# EAGLE design Battery_Buttons (EAGLE 7.6.0)
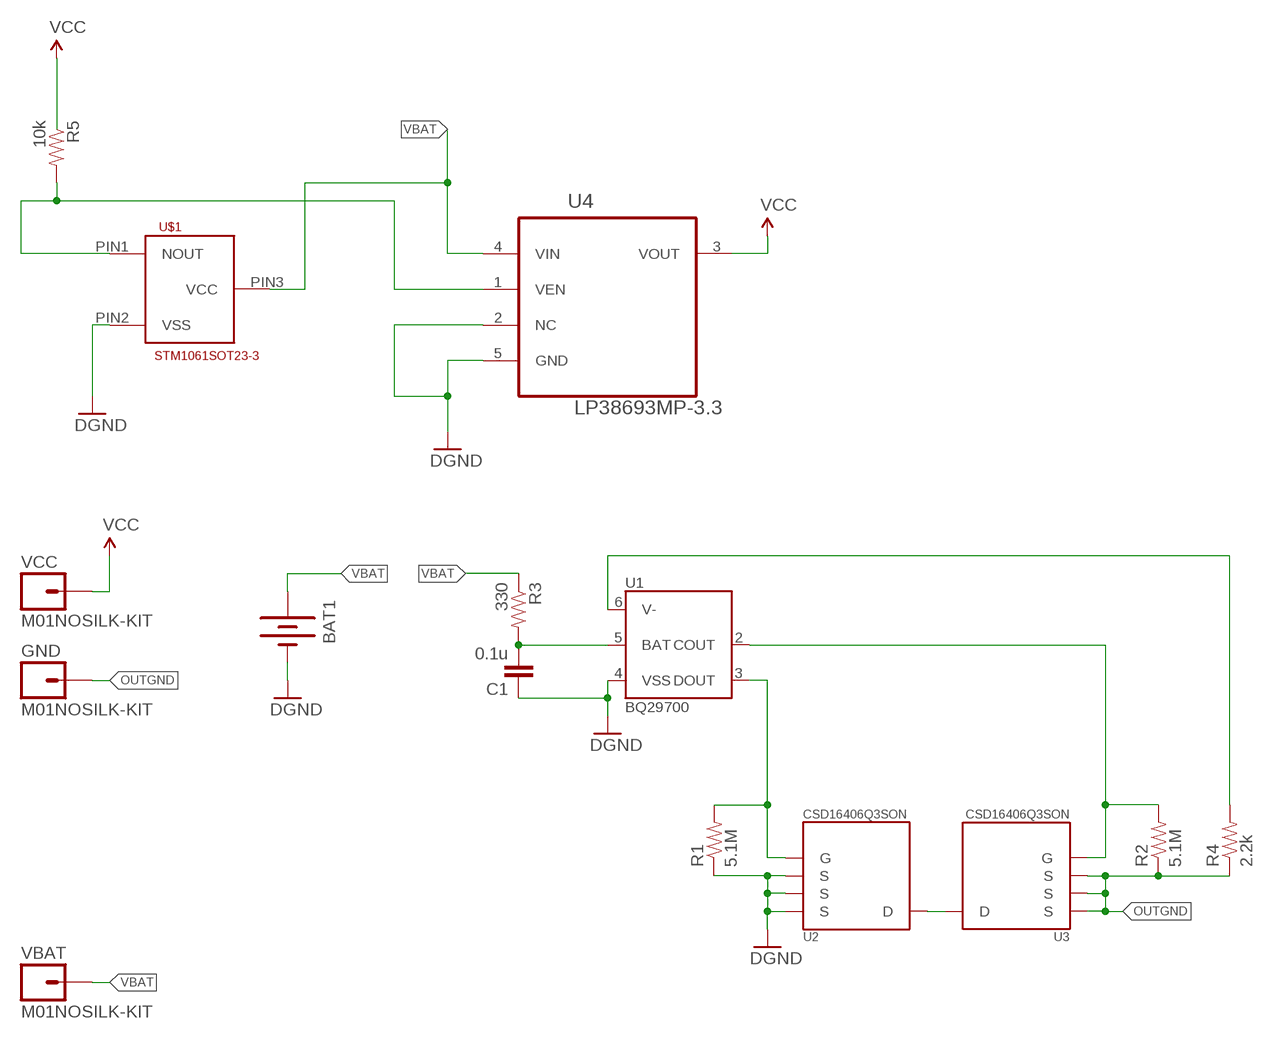
[diagram p0: schematic, sheet 1]

## Parts
BAT1  BATTERY245PTH  [BATTCON_245MM_PTH]
C1  0.1u  CAP0603-CAP  [0603-CAP]
GND  M01NOSILK-KIT  [1X01NS-KIT]
R1  5.1M  RESISTOR0603-RES  [0603-RES]
R2  5.1M  RESISTOR0603-RES  [0603-RES]
R3  330  RESISTOR0603-RES  [0603-RES]
R4  2.2k  RESISTOR0603-RES  [0603-RES]
R5  10k  RESISTOR0603-RES  [0603-RES]
U1  BQ29700  [WSON(6)]
U2  CSD16406Q3SON  [SON(330X330)]
U3  CSD16406Q3SON  [SON(330X330)]
U4  LP38693MP-3.3  [SOT150P696X180-5N]
U$1  STM1061SOT23-3  [STM1061]
VBAT  M01NOSILK-KIT  [1X01NS-KIT]
VCC  M01NOSILK-KIT  [1X01NS-KIT]

## Nets
DGND: BAT1.GND(-) C1.1 R1.1 U1.4(VSS) U2.1(S) U2.2(S) U2.3(S)
GND: U4.2(NC) U4.5(GND) U$1.PIN2(VSS) ; supply symbol labelled DGND
N$1: U2.5(D) U3.5(D)
N$2: C1.2 R3.2 U1.5(BAT)
N$4: R5.2 U4.1(VEN) U$1.PIN1(NOUT)
N$5: R1.2 U1.3(DOUT) U2.4(G)
N$6: R2.2 U1.2(COUT) U3.4(G)
N$7: R4.2 U1.6(V-)
N$11: U4.4(VIN) U$1.PIN3(VCC)
OUTGND: GND.1 R2.1 R4.1 U3.1(S) U3.2(S) U3.3(S)
VBAT: BAT1.POS1(+) BAT1.POS2(+) R3.1 VBAT.1
VCC: U4.3(VOUT) VCC.1
Unconnected: R5.1 U1.1(NC)

## Library data of the parts
BAT1 = SparkFun-Electromechanical:BATTERY: Battery Holders Various common sizes : AA, AAA, 20mm coin cell and 12mm coin cell. 20MM_4LEGS, BATT-10373; OC_FARNELL: unknown
C1 = SparkFun-Capacitors:CAP: Capacitor Standard 0603 ceramic capacitor, and 0.1" leaded capacitor.
GND VBAT VCC = SparkFun-Connectors:M01: Header 1 Standard 1-pin 0.1" header. Use with straight break away headers (SKU : PRT-00116), right angle break away headers (PRT-00553), swiss pins (PRT-00743), machine pins (PRT-00117), and female headers (PRT-00115).; OC_FARNELL: unknown
R1-R5 = SparkFun-Passives:RESISTOR: Resistor Basic schematic elements and footprints for 0603, 1206, and PTH resistors.
U1 = TI_by_VG:BQ29700: BQ29700 Li-Ion protection circuit. The bq297xy battery cell protection device provides an accurate monitor and trigger threshold for overcurrent protection during high discharge/charge current operation or battery overcharge conditions. The bq297xy device provides the protection functions for Li-Ion/Li-Polymer cells, and monitors across the external power FETs for protection due to high charge or discharge currents. In addition, there is overcharge and depleted battery monitoring and protection. These features are implemented with low current consumption in NORMAL mode operation
U2 U3 = TI_by_VG:CSD16406Q3: N-channel power MOSFET Designed to minimize losses in power conversion applications. For full information see: Link to product page at TI.com <http://www.ti.com/product/csd16406q3>
U4 = LP3869Regulator:LP38693MP-3.3: Linear Regulators; MPN: LP38693MP-3.3; OC_FARNELL: 1008061; OC_NEWARK: 41K7496; PACKAGE: SOT-223-5; SUPPLIER: National
U$1 = STM1061:STM1061: STM1061 SOT-23-3 Package Low Power Voltage Detector

## Board
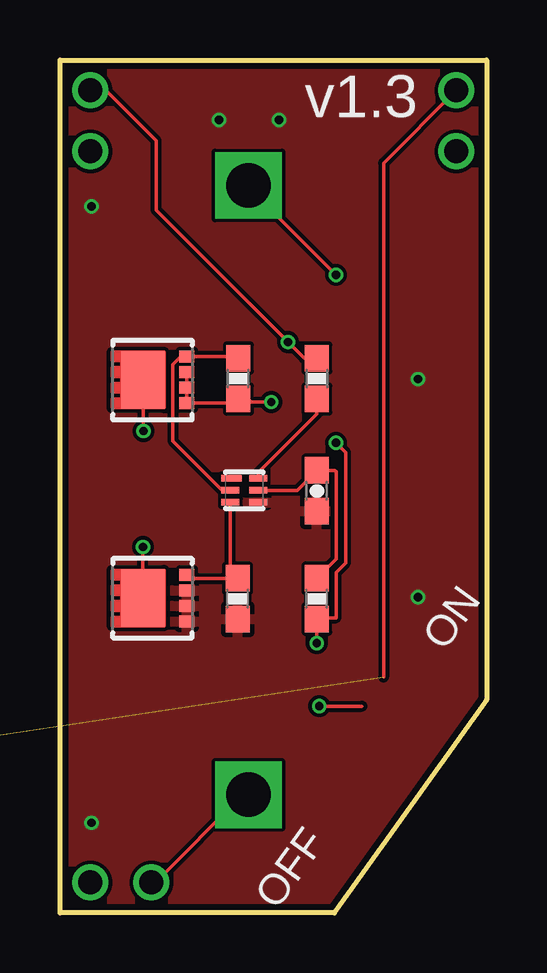
[diagram p1: board, top side]
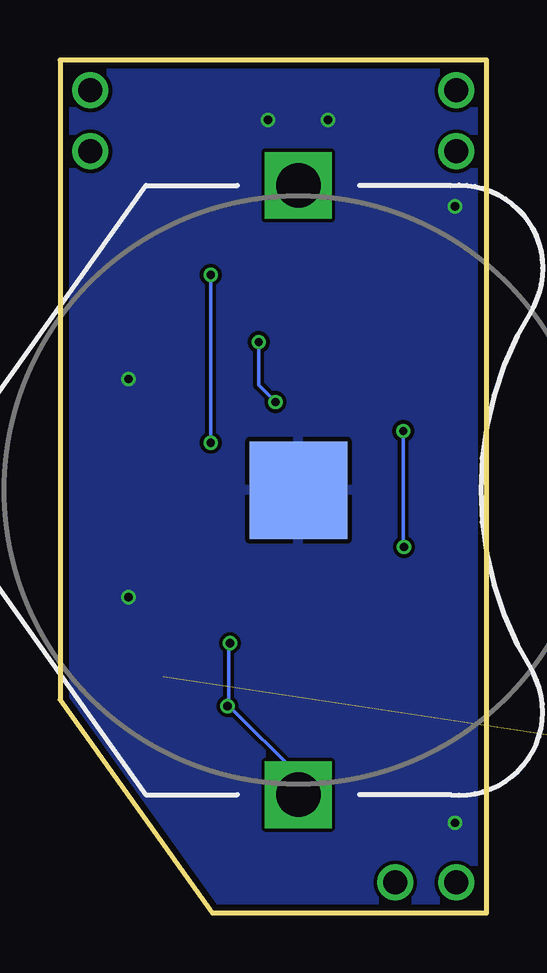
[diagram p2: board, bottom side, seen from below]

Size 17.78 x 35.56 mm. Coordinates in mm from the lower left corner, seen from the top.
Outline: 17.78,35.56 17.78,8.89 11.43,0 0,0 0,35.56 17.78,35.56
Copper layers (1*16): Top 0.018mm / dielectric 1.55mm / Bottom 0.018mm
Design rules "eC_2Layer_PClass6_BaseCopperO18_eCDefault": minimum track width 0.15mm, minimum drill 0.35mm, track to track 0.15mm, track to pad 0.15mm, pad to pad 0.15mm, via to via 0.15mm, smd to smd 0mil, copper to edge 0.25mm, drill to drill 0.35mm, minimum pad ring 0.175mm, minimum via ring 0.125mm, stop-mask expansion 0mil, vias tented up to drill 0.45mm, thermal gap 0.2mm

### Footprints (pad centres in the part's own frame; a part is rotated, then mirrored left to right if it is on the bottom)
BATTCON_245MM_PTH = smd 4.064 x 4.064: GND 0,0 | drill 1.854 square: POS1 -12.7,0; POS2 12.7,0
0603-CAP = smd 1.1 x 1: 1 -0.85,0; 2 0.85,0
1X01NS-KIT = drill 1: 1 0,0
0603-RES = smd 1.1 x 1: 1 -0.85,0; 2 0.85,0
WSON(6) = smd 0.28 x 0.85: 1 0.28,0.25 | smd 0.28 x 0.75: 2 0.78,0.2; 3 1.28,0.2; 4 1.28,1.35; 5 0.78,1.35; 6 0.28,1.35
SON(330X330) = smd 0.63 x 0.5: 1 3.185,0.25; 2 3.185,0.9; 3 3.185,1.55; 4 3.185,2.2 | smd 1.8 x 2.4: 5 1.36,1.225
SOT150P696X180-5N = smd 1.6 x 0.838: 1 -3.2,2.261; 2 -3.2,0.762; 3 -3.2,-0.762; 4 -3.2,-2.261 | smd 1.6 x 2.997: 5 3.2,0
STM1061 = smd 0.65 x 0.5: PIN1 -1.036,0.95; PIN2 -1.037,-0.957; PIN3 1.011,-0.003

### Placement (x,y rotation side)
BAT1  7.85,17.63 270 bottom
C1  10.7,17.6 90 top
GND  1.27,34.29 0 top
R1  7.4,13.1 90 top
R2  7.43,22.28 90 top
R3  10.7,13.1 90 top
R4  10.7,22.28 270 top
R5  -19.05,-2.54 0 top  (outside the outline)
U1  6.9,18.4 270 top
U2  2.1,11.9 0 top
U3  2.1,21 0 top
U4  -11.43,6.35 0 top  (outside the outline)
U$1  -20.32,1.27 0 top  (outside the outline)
VBAT  3.81,1.27 0 top
VCC  16.51,34.29 0 top

### Tracks (layer width: path | path; a pad name or v marks a point on that pad's centre or on a via)
DGND  (via drill 0.35)
  Top 0.15: R1.1 7.7,12.18
  other vias: 1.32,3.76 6.62,33.06 9.12,33.06 14.92,22.26 14.92,13.16 1.32,29.46
  pour Top: 0,0 0,35.56 17.78,35.56 17.78,8.89 11.43,0
  pour Bottom: 0,0 0,35.56 17.78,35.56 17.78,8.89 11.43,0
GND  (2 unrouted)
N$1  (via drill 0.35)
  Top 0.15: 3.5,22.2 U3.5 3.46,20.11 v3.48,20.09 | 3.5,13.2 U2.5 3.45,13.13 v3.45,15.26
  Bottom 0.15: v3.45,15.26 3.48,15.29 v3.48,20.09
N$2
  Top 0.15: U1.5 9.88,17.62 C1.2 11.45,18.45 11.5,18.4 11.5,14.75 R3.2
N$3  (via drill 1)
  other vias: 1.27,31.75
N$4  (2 unrouted)
N$5
  Top 0.15: U2.4 5.43,13.95 R1.2 7.1,14.25 U1.3
N$6
  Top 0.15: R2.2 7.66,23.2 U3.4 5.04,23.2 4.7,22.86 4.7,19.68 6.76,17.62 U1.2
N$7
  Top 0.15: R4.2 10.7,20.8 8.26,18.36 U1.6
N$8  (via drill 1)
  other vias: 1.27,1.27
N$9  (via drill 1)
  other vias: 16.51,31.75
N$11  (1 unrouted)
OUTGND  (via drill 0.35)
  Top 0.15: U3.3 5.28,21.96 U3.2 U3.1 5.36,21.26 7.56,21.26 R2.1 7.8,21.46 7.96,21.3 v8.8,21.3 | R4.1 10.17,23.13 v9.5,23.8 4,29.3 4,32.2 1.91,34.29 GND.1
  Bottom 0.15: v8.8,21.3 9.5,22 v9.5,23.8
VBAT  (via drill 0.35)
  Top 0.15: v10.7,11.24 R3.1 10.75,12.3 11.5,12.3 11.5,14.2 11.9,14.6 11.9,19.2 v11.5,19.6 | v10.8,8.62 12.58,8.62 | VBAT.1 3.98,1.28 7.62,4.92 BAT1.POS2 | v11.5,26.6 7.85,30.25 BAT1.POS1
  Bottom 0.15: 10.74,8.64 10.74,11.24 v10.7,11.24 | 10.74,8.64 7.86,5.76 BAT1.POS2 | v10.8,8.62 10.74,8.64 | v11.5,19.6 v11.5,26.6
VCC  (1 unrouted)
  Top 0.15: 13.48,9.84 13.48,31.26 VCC.1
  Bottom 0.15: VCC.1

### Text on the board
tPlace: v1.3 | ON | OFF